# EAGLE design Fingertip (EAGLE 9.3.0)
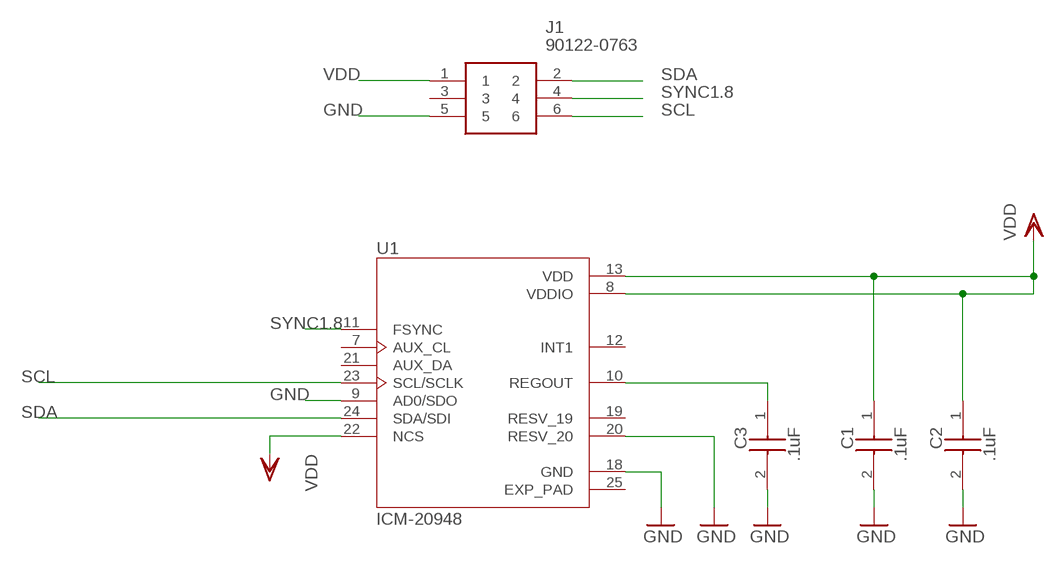
[diagram p0: schematic, sheet 1]

## Parts
C1  .1uF  C0805C104K6RACTU  [CAPC2012X88N]
C2  .1uF  C0805C104K6RACTU  [CAPC2012X88N]
C3  .1uF  C0805C104K6RACTU  [CAPC2012X88N]
J1  90122-0763  [SHDR6W90P254_2X3_762X605X684P]
U1  ICM-20948  [QFN40P300X300X105-25N]

## Nets
GND: C1.2 C2.2 C3.2 J1.5 U1.9(AD0/SDO) U1.18(GND) U1.20(RESV_20)
N$3: C3.1 U1.10(REGOUT)
SCL: J1.6 U1.23(SCL/SCLK)
SDA: J1.2 U1.24(SDA/SDI)
SYNC1.8: J1.4 U1.11(FSYNC)
VDD: C1.1 C2.1 J1.1 U1.8(VDDIO) U1.13(VDD) U1.22(NCS)
Unconnected: J1.3 U1.7(AUX_CL) U1.12(INT1) U1.19(RESV_19) U1.21(AUX_DA)

## Power pins joined to a net without a drawn wire
EXP_PAD: U1.25(EXP_PAD)

## Library data of the parts
C1-C3 = SamacSys_Parts:C0805C104K6RACTU: KEMET - C0805C104K6RACTU - CAP, MLCC, X7R, 0.1UF, 35V, 0805 Source: Datasheet <https://componentsearchengine.com/Datasheets/1/C0805C104K6RACTU.pdf>; DESCRIPTION: KEMET - C0805C104K6RACTU - CAP, MLCC, X7R, 0.1UF, 35V, 0805; HEIGHT: 0.88mm; MANUFACTURER_NAME: Kemet; MANUFACTURER_PART_NUMBER: C0805C104K6RACTU; MOUSER_PART_NUMBER: 80-C0805C104K6R
J1 = SamacSys_Parts:90122-0763: Molex C-GRID III Series, Series Number 90122, 2.54mm Pitch 6 Way 2 Row Right Angle PCB Header, Solder Termination, 3A Source: Datasheet <http://www.mouser.com/datasheet/2/276/0901220763_PCB_HEADERS-230116.pdf>; DESCRIPTION: Molex C-GRID III Series, Series Number 90122, 2.54mm Pitch 6 Way 2 Row Right Angle PCB Header, Solder Termination, 3A; HEIGHT: 6.84mm; MANUFACTURER_NAME: Molex; MANUFACTURER_PART_NUMBER: 90122-0763; MOUSER_PART_NUMBER: 538-90122-0763; MOUSER_PRICE-STOCK: https://www.mouser.com/Search/Refine.aspx?Keyword=538-90122-0763
U1 = ICM-20948:ICM-20948: Axis=3 Axis Gyro+3 Axis Accel+Compass. Pin For Pin With m; DESCRIPTION: 9 Axis=3 Axis Gyro+3 Axis Accel+Compass. Pin For Pin With m; DIGI-KEY_PART_NUMBER: 1428-1123-1-ND; DIGI-KEY_PURCHASE_URL: https://www.digikey.com/product-detail/en/tdk-invensense/ICM-20948/1428-1123-1-ND/7062698?utm_source=snapeda&utm_medium=aggregator&utm_campaign=symbol; MF: TDK InvenSense; MP: ICM-20948; PACKAGE: QFN-24 InvenSense

## Board
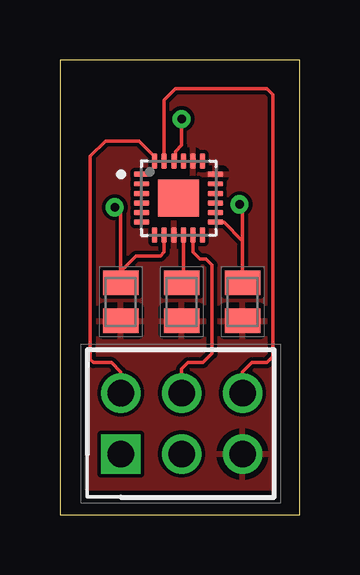
[diagram p1: board, top side]
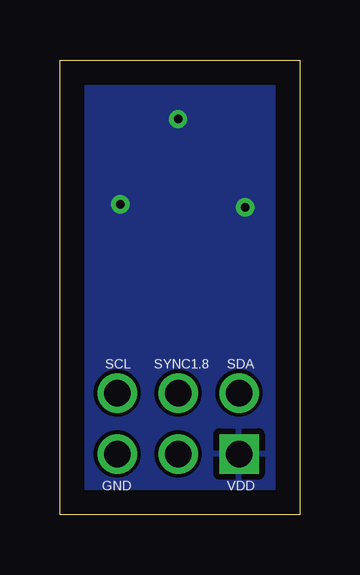
[diagram p2: board, bottom side, seen from below]

Size 10.01 x 18.97 mm. Coordinates in mm from the lower left corner, seen from the top.
Outline: 0,0 10.01,0 10.01,18.97 0,18.97 0,0
Copper layers (1*16): Top 0.035mm / dielectric 1.5mm / Bottom 0.035mm
Design rules "default": minimum track width 6mil, minimum drill 0.35mm, track to track 6mil, track to pad 6mil, pad to pad 6mil, via to via 6mil, smd to smd 6mil, copper to edge 40mil, drill to drill 6mil, minimum pad ring 10mil, minimum via ring 8mil, stop-mask expansion 4mil, vias tented up to drill 0mil, thermal gap 10mil

### Footprints (pad centres in the part's own frame; a part is rotated, then mirrored left to right if it is on the bottom)
CAPC2012X88N = smd 1.02 x 1.47: 1 -0.8,0; 2 0.8,0
SHDR6W90P254_2X3_762X605X684P = drill 1.1 pad 1.65 square: 1 0,0 | drill 1.1 pad 1.65: 2 0,2.54; 3 2.54,0; 4 2.54,2.54; 5 5.08,0; 6 5.08,2.54
QFN40P300X300X105-25N = smd 0.64 x 0.22: 1 -1.545,1; 2 -1.545,0.6; 3 -1.545,0.2; 4 -1.545,-0.2; 5 -1.545,-0.6; 6 -1.545,-1; 13 1.545,-1; 14 1.545,-0.6; 15 1.545,-0.2; 16 1.545,0.2; 17 1.545,0.6; 18 1.545,1 | smd 0.22 x 0.64: 7 -1,-1.545; 8 -0.6,-1.545; 9 -0.2,-1.545; 10 0.2,-1.545; 11 0.6,-1.545; 12 1,-1.545; 19 1,1.545; 20 0.6,1.545; 21 0.2,1.545; 22 -0.2,1.545; 23 -0.6,1.545; 24 -1,1.545 | smd 1.7 x 1.54: 25 0,0

### Placement (x,y rotation side)
C1  7.62,8.89 270 top
C2  2.54,8.89 270 top
C3  5.08,8.89 270 top
J1  2.54,2.54 0 top
U1  4.95,13.21 0 top

### Tracks (layer width: path | path; a pad name or v marks a point on that pad's centre or on a via)
GND
  pour Top: 0.38,18.54 0.38,0.13 9.78,0.13 9.78,18.54
N$3
  Top 0.152: U1.10 5.15,9.76 C3.1
SCL
  Top 0.152: J1.6 7.62,5.97 8,6.35 8.64,6.35 8.89,6.6 8.89,17.53 8.64,17.78 4.83,17.78 4.35,17.31 U1.23
SDA
  Top 0.152: J1.2 2.54,5.97 2.16,6.35 1.4,6.35 1.27,6.48 1.27,14.96 1.91,15.6 3.3,15.6 3.94,14.96 3.94,14.77 U1.24
SYNC1.8
  Top 0.152: J1.4 5.08,6.1 5.33,6.35 5.97,6.35 6.35,6.73 6.35,10.41 6.1,10.67 5.84,10.67 5.55,10.96 U1.11
VDD  (via drill 0.35)
  Top 0.152: U1.8 4.35,10.96 4.19,10.79 3.17,10.79 2.54,10.16 | U1.13 6.84,12.21 7.62,11.43 | 7.62,11.43 C1.1 | U1.22 4.81,14.81 4.81,15.15 5.08,15.42 v5.08,16.51 | v2.29,12.83 2.54,12.57 2.54,10.16 | 2.54,10.16 C2.1 | v7.49,12.95 7.62,12.83 7.62,11.43
  pour Bottom: 0.38,18.54 0.38,0.25 9.78,0.25 9.78,18.54

### Text on the board
bPlace: SDA | SYNC1.8 | SCL | VDD | GND